# EAGLE design NanoSignalDecoder (EAGLE 7.7.0)
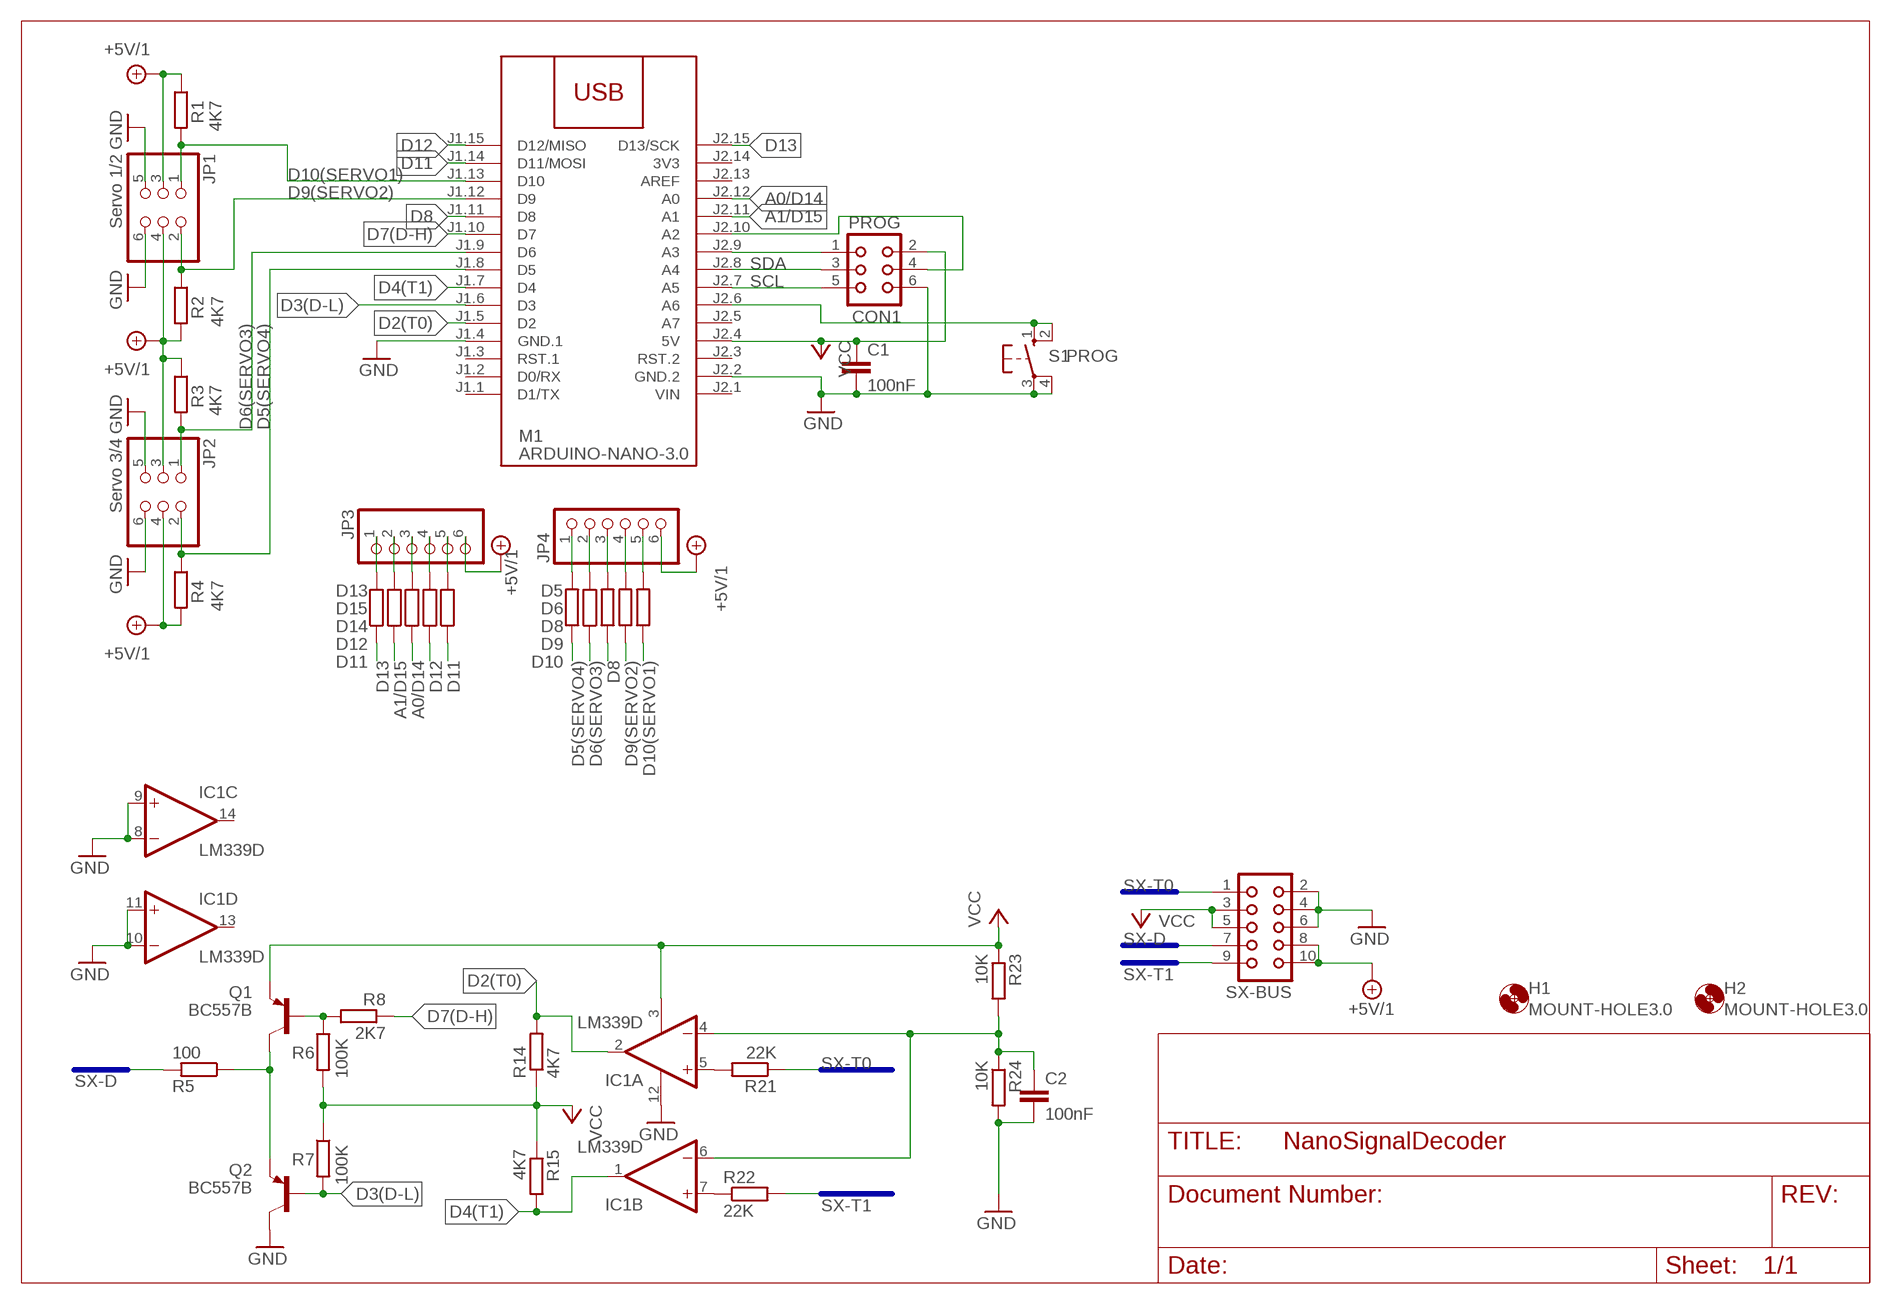
[diagram p0: schematic, sheet 1]

## Parts
C1  100nF  C-EUC0805  [C0805]
C2  100nF  C-EUC0805  [C0805]
CON1  PROG  CON06  [CON06]
D5  500  R-EU_R0805  [R0805]
D6  500  R-EU_R0805  [R0805]
D8  500  R-EU_R0805  [R0805]
D9  500  R-EU_R0805  [R0805]
D10  500  R-EU_R0805  [R0805]
D11  500  R-EU_R0805  [R0805]
D12  500  R-EU_R0805  [R0805]
D13  500  R-EU_R0805  [R0805]
D14  500  R-EU_R0805  [R0805]
D15  500  R-EU_R0805  [R0805]
H1  MOUNT-HOLE3.0  [3,0]
H2  MOUNT-HOLE3.0  [3,0]
IC1  LM339D  [SO14]
JP1  Servo 1/2  PINHD-2X3/90  [2X03/90]
JP2  Servo 3/4  PINHD-2X3/90  [2X03/90]
JP3  PINHD-1X6  [1X06]
JP4  PINHD-1X6  [1X06]
M1  ARDUINO-NANO-3.0  [ARDUINO-NANO-3.0]
Q1  BC557B  [TO92-EBC]
Q2  BC557B  [TO92-EBC]
R1  4K7  R-EU_R0805  [R0805]
R2  4K7  R-EU_R0805  [R0805]
R3  4K7  R-EU_R0805  [R0805]
R4  4K7  R-EU_R0805  [R0805]
R5  100  R-EU_R0805  [R0805]
R6  100K  R-EU_R0805  [R0805]
R7  100K  R-EU_R0805  [R0805]
R8  2K7  R-EU_R0805  [R0805]
R14  4K7  R-EU_R0805  [R0805]
R15  4K7  R-EU_R0805  [R0805]
R21  22K  R-EU_R0805  [R0805]
R22  22K  R-EU_R0805  [R0805]
R23  10K  R-EU_R0805  [R0805]
R24  10K  R-EU_R0805  [R0805]
S1  PROG  10-XX  [B3F-10XX]
SX-BUS  CON10  [CON10]

## Nets
+5V/1: JP1.3 JP1.4 JP2.3 JP2.4 JP3.6 JP4.6 R1.1 R2.2 R3.1 R4.2 SX-BUS.8 SX-BUS.10
A0/D14: D14.1 M1.J2.12(A0)
A1/D15: D15.1 M1.J2.11(A1)
D2(T0): IC1.2(A:OUT) M1.J1.5(D2) R14.2
D3(D-L): M1.J1.6(D3) Q2.B R7.2
D4(T1): IC1.1(B:OUT) M1.J1.7(D4) R15.2
D5(SERVO4): D5.1 JP2.2 M1.J1.8(D5) R4.1
D6(SERVO3): D6.1 JP2.1 M1.J1.9(D6) R3.2
D7(D-H): M1.J1.10(D7) R8.1
D8: D8.1 M1.J1.11(D8)
D9(SERVO2): D9.1 JP1.2 M1.J1.12(D9) R2.1
D10(SERVO1): D10.1 JP1.1 M1.J1.13(D10) R1.2
D11: D11.1 M1.J1.14(D11/MOSI)
D12: D12.1 M1.J1.15(D12/MISO)
D13: D13.1 M1.J2.15(D13/SCK)
GND: C1.2 C2.2 CON1.6 IC1.8(C:-IN) IC1.9(C:+IN) IC1.10(D:-IN) IC1.11(D:+IN) IC1.12(P:GND) JP1.5 JP1.6 JP2.5 JP2.6 M1.J1.4(GND.1) M1.J2.2(GND.2) Q2.C R24.2 S1.3(P) S1.4(P1) SX-BUS.2 SX-BUS.4 SX-BUS.6
N$2: D8.2 JP4.3
N$3: D5.2 JP4.1
N$4: D13.2 JP3.1
N$5: D6.2 JP4.2
N$6: D15.2 JP3.2
N$7: C2.1 IC1.4(A:-IN) IC1.6(B:-IN) R23.2 R24.1
N$8: Q1.C Q2.E R5.1
N$9: D9.2 JP4.4
N$10: D10.2 JP4.5
N$11: D14.2 JP3.3
N$12: D12.2 JP3.4
N$13: D11.2 JP3.5
N$14: Q1.B R6.1 R8.2
N$15: M1.J2.6(A6) S1.1(S) S1.2(S1)
N$16: CON1.1 M1.J2.9(A3)
N$22: CON1.4 M1.J2.10(A2)
N$30: IC1.5(A:+IN) R21.2
N$31: IC1.7(B:+IN) R22.1
SCL: CON1.5 M1.J2.7(A5)
SDA: CON1.3 M1.J2.8(A4)
SX-D: R5.2 SX-BUS.7
SX-T0: R21.1 SX-BUS.1
SX-T1: R22.2 SX-BUS.9
VCC: C1.1 CON1.2 IC1.3(P:V+) M1.J2.4(5V) Q1.E R6.2 R7.1 R14.1 R15.1 R23.1 SX-BUS.3 SX-BUS.5
Unconnected: IC1.13(D:OUT) IC1.14(C:OUT) M1.J1.1(D1/TX) M1.J1.2(D0/RX) M1.J1.3(RST.1) M1.J2.3(RST.2) M1.J2.5(A7) M1.J2.13(AREF)

## Buses
SX-T0
SX-T1
SX-D

## Power pins joined to a net without a drawn wire
3V3: M1.J2.14(3V3)
VIN: M1.J2.1(VIN)

## Library data of the parts
C1 C2 = resistor:C-EU: CAPACITOR, European symbol
CON1 = con-harting:CON06: CONNECTOR; OC_FARNELL: unknown; OC_NEWARK: unknown
D5 D6 D8-D15 R1-R8 R15 R21 = rcl:R-EU_: RESISTOR, European symbol
H1 H2 = holes:MOUNT-HOLE: MOUNTING HOLE with drill center marker
IC1 = linear:LM339: Low Power Low Offset Voltage Quad Comparators with open collector; LM139/LM239/LM339/LM2901/LM3302
JP1 JP2 = pinhead:PINHD-2X3: PIN HEADER
JP3 JP4 = pinhead:PINHD-1X6: PIN HEADER
M1 = diy-modules:ARDUINO-NANO-3.0: Arduino Nano 3.0
Q1 Q2 = transistor-pnp:BC557*: PNP Transistror
R14 R22-R24 = resistor:R-EU_: RESISTOR, European symbol
S1 = switch-omron:10-XX: OMRON SWITCH; MPN: B3F-1000; OC_FARNELL: 176432; OC_NEWARK: 36M3542
SX-BUS = con-harting:CON10: CONNECTOR; OC_FARNELL: unknown; OC_NEWARK: unknown

## Board
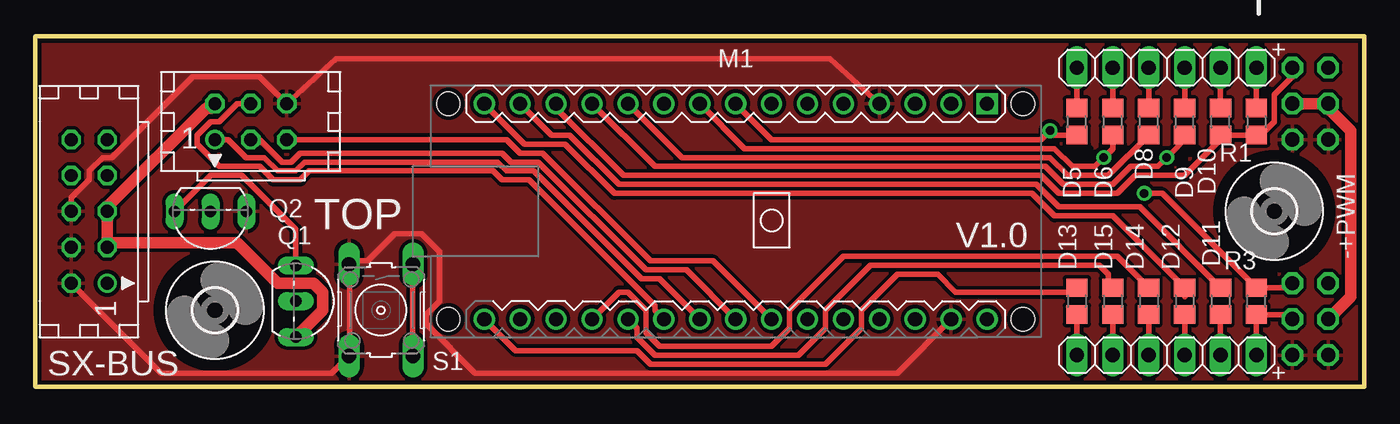
[diagram p1: board, top side]
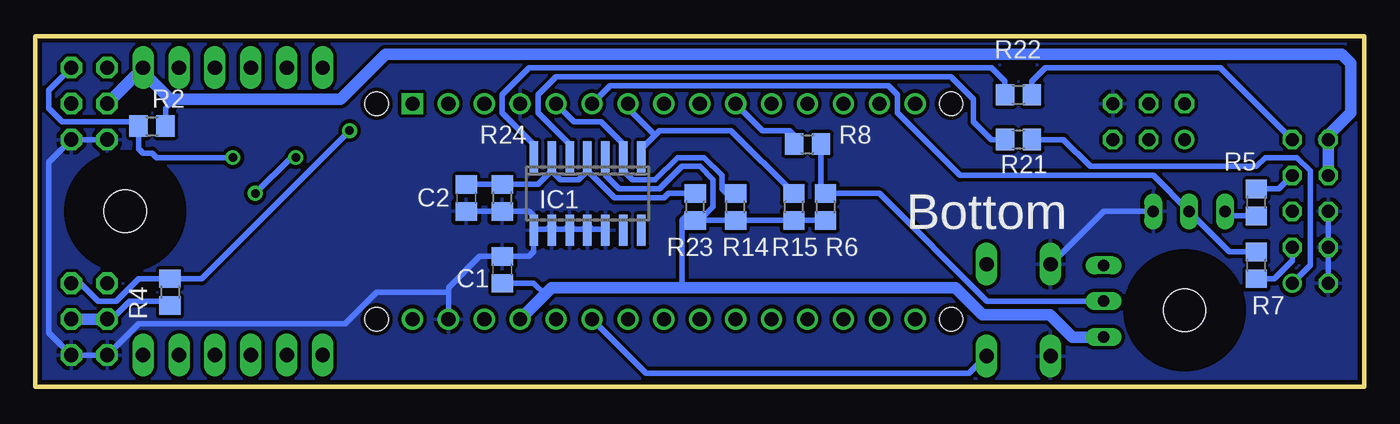
[diagram p2: board, bottom side, seen from below]

Size 93.98 x 24.77 mm. Coordinates in mm from the lower left corner, seen from the top.
Outline: 0,0 0,24.77 93.98,24.77 93.98,0 0,0
Copper layers (1*16): Top 0.035mm / dielectric 0.2mm / Bottom 0.035mm
Design rules "Eagle_WEdirekt_150_check *": minimum track width 6mil, minimum drill 0.25mm, track to track 6mil, track to pad 8mil, pad to pad 8mil, via to via 6mil, smd to smd 8mil, copper to edge 12mil, drill to drill 24mil, minimum pad ring 9mil, minimum via ring 9mil, stop-mask expansion 3mil, vias tented up to drill 0mil, thermal gap 12mil
tRestrict: area 17.1,4.4 to 18.1,5.1; area 18.1,4.8 to 18.7,5.1; area 16.8,4.1 to 17.5,4.4; area 77.8,16.2 to 79.4,16.5; area 76.5,16.5 to 77.2,16.8; area 81,15.6 to 81.3,16.8; area 81.6,16.5 to 82.2,16.8; area 73,16.2 to 74.6,16.8; area 86.7,20.6 to 87.3,21; area 76.2,8.3 to 76.5,8.6; area 76.5,7.9 to 76.8,8.3; area 86,7.9 to 86.7,8.3; 3 more areas
bRestrict: area 39.1,12.4 to 39.4,13; area 45.4,12.4 to 45.7,12.7; area 61.9,13 to 62.5,13.7; area 85.7,6.7 to 86.4,7; area 86.4,6.7 to 87,7; area 86.7,6.3 to 87,6.7; area 85.7,20 to 87.3,20.6; area 85.1,19.7 to 87.6,20; area 87.6,19.1 to 87.9,19.7; area 23.5,21.9 to 25.4,22.9; area 0.3,23.8 to 1,24.4; area 4.1,8.9 to 4.4,9.2; 1 more areas

### Footprints (pad centres in the part's own frame; a part is rotated, then mirrored left to right if it is on the bottom)
C0805 = smd 1.3 x 1.5: 1 -0.95,0; 2 0.95,0
CON06 = drill 0.914: 1 -2.54,-1.27 | drill 0.914 octagon: 2 -2.54,1.27; 3 0,-1.27; 4 0,1.27; 5 2.54,-1.27; 6 2.54,1.27
R0805 = smd 1.3 x 1.5: 1 -0.95,0; 2 0.95,0
3,0 = hole 3: 0,0
SO14 = smd 0.6 x 2.2: 1 -3.81,-2.6; 2 -2.54,-2.6; 3 -1.27,-2.6; 4 0,-2.6; 5 1.27,-2.6; 6 2.54,-2.6; 7 3.81,-2.6; 8 3.81,2.6; 9 2.54,2.6; 10 1.27,2.6; 11 0,2.6; 12 -1.27,2.6; 13 -2.54,2.6; 14 -3.81,2.6
2X03/90 = drill 1.016 octagon: 1 -2.54,-6.35; 2 -2.54,-3.81; 3 0,-6.35; 4 0,-3.81; 5 2.54,-6.35; 6 2.54,-3.81
1X06 = drill 1.016 long: 1 -6.35,0; 2 -3.81,0; 3 -1.27,0; 4 1.27,0; 5 3.81,0; 6 6.35,0
ARDUINO-NANO-3.0 = drill 1 square: J1.1 17.78,7.62 | drill 1: J1.2 15.24,7.62; J1.3 12.7,7.62; J1.4 10.16,7.62; J1.5 7.62,7.62; J1.6 5.08,7.62; J1.7 2.54,7.62; J1.8 0,7.62; J1.9 -2.54,7.62; J1.10 -5.08,7.62; J1.11 -7.62,7.62; J1.12 -10.16,7.62; J1.13 -12.7,7.62; J1.14 -15.24,7.62; J1.15 -17.78,7.62; J2.1 17.78,-7.62; J2.2 15.24,-7.62; J2.3 12.7,-7.62; J2.4 10.16,-7.62; J2.5 7.62,-7.62; J2.6 5.08,-7.62; J2.7 2.54,-7.62; J2.8 0,-7.62; J2.9 -2.54,-7.62; J2.10 -5.08,-7.62; J2.11 -7.62,-7.62; J2.12 -10.16,-7.62; J2.13 -12.7,-7.62; J2.14 -15.24,-7.62; J2.15 -17.78,-7.62 | hole 1.651: -20.32,7.62; -20.32,-7.62; 20.32,-7.62; 20.32,7.62
TO92-EBC = drill 0.813 long: B 0,-1.27; C -2.54,-1.27; E 2.54,-1.27
B3F-10XX = drill 1.016 long: 1 -3.251,2.261; 2 3.251,2.261; 3 -3.251,-2.261; 4 3.251,-2.261
CON10 = drill 0.914: 1 -5.08,-1.27 | drill 0.914 octagon: 2 -5.08,1.27; 3 -2.54,-1.27; 4 -2.54,1.27; 5 0,-1.27; 6 0,1.27; 7 2.54,-1.27; 8 2.54,1.27; 9 5.08,-1.27; 10 5.08,1.27

### Placement (x,y rotation side)
C1  60.96,8.26 90 bottom
C2  63.5,13.34 270 bottom
CON1  15.24,18.73 0 top
D5  73.66,18.73 90 top
D6  76.2,18.73 90 top
D8  78.74,18.73 90 top
D9  81.28,18.73 90 top
D10  83.82,18.73 90 top
D11  83.82,6.03 270 top
D12  81.28,6.03 270 top
D13  73.66,6.03 270 top
D14  78.74,6.03 270 top
D15  76.2,6.03 270 top
H1  12.7,5.4 0 top
H2  87.63,12.38 0 top
IC1  54.93,13.65 180 bottom
JP1  95.25,20 270 top
JP2  95.25,4.76 270 top
JP3  80.01,2.22 0 top
JP4  80.01,22.54 0 top
M1  49.53,12.38 0 top
Q1  19.68,6.03 270 top
Q2  12.38,11.11 180 top
R1  86.36,18.73 270 top
R2  85.72,18.41 0 bottom
R3  86.36,6.03 90 top
R4  84.45,6.67 270 bottom
R5  7.62,13.02 90 bottom
R6  38.1,12.7 270 bottom
R7  7.62,8.57 90 bottom
R8  39.37,17.14 0 bottom
R14  44.45,12.7 90 bottom
R15  40.32,12.7 90 bottom
R21  24.45,17.46 180 bottom
R22  24.45,20.64 0 bottom
R23  47.31,12.7 90 bottom
R24  60.96,13.34 270 bottom
S1  24.45,5.4 270 top
SX-BUS  3.81,12.38 90 top

### Tracks (layer width: path | path; a pad name or v marks a point on that pad's centre or on a via)
+5V/1
  Top 0.406: JP4.6 86.36,20 86.68,19.68 86.36,19.37 R1.1 | JP3.6 86.36,4.76 86.04,5.08 86.36,5.4 R3.1 88.58,5.08 JP2.3
  Top 0.813: JP1.3 JP1.4 91.44,19.68 93.03,18.1 93.03,6.35 JP2.4
  Bottom 0.406: JP2.3 88.58,4.76 87.31,6.03 84.45,6.03 R4.2 | 84.3,20.16 84.77,19.68 R2.2
  Bottom 0.813: JP2.4 JP2.3 | SX-BUS.8 SX-BUS.10 | 2.86,17.46 SX-BUS.10 | JP1.3 JP4.6 86.36,22.23 84.3,20.16 84.14,20.32 72.39,20.32 69.22,23.5 1.59,23.5 0.95,22.86 0.95,19.37 2.54,17.78 SX-BUS.10
A0/D14
  Top 0.406: 78.42,6.67 78.74,6.67 D14.1 76.52,9.21 57.15,9.21 53.34,5.4 53.34,4.13 52.07,2.86 44.13,2.86 43.18,3.81 43.18,5.4 41.91,6.67 41.27,6.67 M1.J2.12
A1/D15
  Top 0.406: 75.88,6.67 76.2,6.67 D15.1 | 75.88,6.99 D15.1 | 75.88,6.99 75.88,7.94 75.25,8.57 59.05,8.57 55.88,5.4 55.88,4.13 53.98,2.22 43.81,2.22 42.55,3.49 42.55,4.13 M1.J2.11 | 75.88,6.99 D15.1
D2(T0)
  Bottom 0.406: M1.J1.5 55.88,18.73 53.98,18.73 52.39,17.14 IC1.2 52.39,15.24 51.75,14.61 50.16,14.61 48.58,16.19 46.67,16.19 45.4,14.92 45.4,13.97 45.09,13.65 R14.2
D3(D-L)
  Bottom 0.406: R7.2 9.53,9.53 Q2.B 14.92,14.92 28.57,14.92 33.02,19.37 33.02,20.64 33.66,21.27 53.34,21.27 M1.J1.6
D4(T1)
  Bottom 0.406: 50.16,17.78 51.12,16.83 IC1.1 | 50.16,17.78 49.85,18.1 44.77,18.1 R15.2 | 50.16,17.78 52.07,19.68 M1.J1.7
D5(SERVO4)  (via drill 0.6)
  Top 0.406: 73.66,17.46 D5.1 | M1.J1.8 52.07,17.46 71.12,17.46 v71.75,18.1 72.07,17.78 D5.1 | D5.1
  Bottom 0.406: R4.1 82.23,7.62 v71.75,18.1 | JP2.2 90.81,7.3 89.53,6.03 88.27,6.03 86.68,7.62 R4.1 | R4.1
D6(SERVO3)  (via drill 0.6)
  Top 0.406: 86.36,6.67 R3.2 | R3.2 79.69,13.65 v78.42,13.65 | JP2.1 88.58,6.99 R3.2 | M1.J1.9 50.16,16.83 72.07,16.83 73.34,15.56 74.93,15.56 v75.56,16.19 76.2,16.83 D6.1
  Bottom 0.406: v78.42,13.65 75.88,16.19 v75.56,16.19
D7(D-H)
  Bottom 0.406: M1.J1.10 42.55,18.1 40.64,18.1 40.32,17.78 R8.1
D8
  Top 0.406: M1.J1.11 45.72,16.19 71.75,16.19 73.03,14.92 75.88,14.92 D8.1
D9(SERVO2)  (via drill 0.6)
  Top 0.406: D9.1 81.6,17.46 D9.1 | M1.J1.12 43.81,15.56 71.44,15.56 72.71,14.29 76.2,14.29 77.47,15.56 79.38,15.56 v80.01,16.19 81.6,17.78 81.28,18.1 D9.1
  Bottom 0.406: JP1.2 93.03,20.95 93.03,19.68 92.08,18.73 86.68,18.73 86.36,18.41 R2.1 86.68,16.83 86.36,16.51 85.72,16.51 85.41,16.19 v80.01,16.19
D10(SERVO1)
  Top 0.406: 83.82,17.46 84.14,17.46 D10.1 | 86.36,17.46 86.68,17.46 | 86.36,17.46 R1.2 | M1.J1.13 36.83,19.68 41.59,14.92 71.12,14.92 72.39,13.65 76.52,13.65 77.79,14.92 81.28,14.92 83.82,17.46 | 83.82,17.46 D10.1 | D10.1 R1.2 | 86.36,17.46 87.63,18.73 87.63,20.64 88.9,21.91 JP1.1 | R1.2
D11
  Top 0.406: 83.82,6.67 D11.1 78.11,12.7 72.39,12.7 70.8,14.29 41.27,14.29 37.78,17.78 36.51,17.78 M1.J1.14
D12
  Top 0.406: 81.28,6.35 D12.1 76.2,12.06 72.07,12.06 70.48,13.65 40.96,13.65 37.47,17.14 34.61,17.14 M1.J1.15
D13
  Top 0.406: 73.34,6.67 73.66,6.67 D13.1 73.34,6.67 | 73.34,6.67 65.09,6.67 63.82,7.94 60.96,7.94 58.42,5.4 58.42,4.13 55.88,1.59 43.5,1.59 42.55,2.54 33.97,2.54 M1.J2.15
GND
  Top 0.406: M1.J1.4 56.2,23.18 21.27,23.18 CON1.6 15.88,21.91 11.11,21.91 5.4,16.19 4.76,16.19 3.81,15.24 3.81,14.61 2.54,13.34 SX-BUS.6 | SX-BUS.2 8.89,0.95 20.95,0.95 21.91,1.91 S1.4 22.23,2.22 22.23,8.57 S1.3 22.23,8.89 23.5,8.89 25.4,10.79 27.3,10.79 28.57,9.53 28.57,6.03 27.62,5.08 27.62,4.45 31.11,0.95 60.96,0.95 M1.J2.2
  Bottom 0.406: JP1.5 JP1.6 93.03,15.88 93.03,3.81 JP2.6 JP2.5 86.68,4.45 72.07,4.45 69.85,6.67 64.77,6.67 | 54.61,11.11 53.66,11.11 IC1.12 | 54.61,11.11 54.93,11.11 IC1.11 | 55.88,11.11 55.24,11.11 54.93,11.43 54.61,11.11 | 55.88,11.11 56.2,11.11 IC1.10 | 57.15,11.11 56.52,11.11 56.2,11.43 55.88,11.11 | 57.15,11.11 57.47,11.11 IC1.9 | 58.74,11.11 57.78,11.11 57.47,11.43 57.15,11.11 | SX-BUS.6 SX-BUS.4 SX-BUS.2 | C1.2 59.05,9.21 58.74,9.53 IC1.8 58.74,11.11 | R24.2 C2.2 | 58.74,11.11 58.74,12.06 59.05,12.38 R24.2 | R24.2 | Q2.C 18.41,12.38 21.91,8.89 S1.3 | 64.77,6.67 64.77,6.99 62.55,9.21 C1.2 | 64.77,6.67 M1.J2.2 | C1.2
  pour Top (isolate 0.254): 0,0 0,24.77 93.98,24.77 93.98,0
  pour Bottom (isolate 0.254): 0,0 0,24.77 93.98,24.77 93.98,0
N$2
  Top 0.406: JP4.3 78.74,20 79.06,19.68 78.74,19.37 D8.2
N$3
  Top 0.406: JP4.1 D5.2
N$4
  Top 0.406: JP3.1 73.66,4.76 73.34,5.08 73.66,5.4 D13.2
N$5
  Top 0.406: JP4.2 D6.2
N$6
  Top 0.406: JP3.2 76.2,4.76 75.88,5.08 76.2,5.4 D15.2
N$7
  Bottom 0.406: R24.1 C2.1 | 57.47,15.24 58.42,14.29 R24.1 | R24.1 | 54.93,15.24 55.56,14.61 56.83,14.61 57.47,15.24 | 57.47,15.24 IC1.6 | 54.93,15.24 53.02,13.34 49.53,13.34 49.21,13.65 R23.2 | 54.93,15.24 IC1.4
N$8
  Top 0.406: Q1.C 18.41,11.11 14.61,14.92 12.38,14.92 Q2.E
  Bottom 0.406: Q2.E 9.53,12.06 R5.1
N$9
  Top 0.406: D9.2 JP4.4
N$10
  Top 0.406: JP4.5 83.82,20 83.5,19.68 83.82,19.37 D10.2
N$11
  Top 0.406: JP3.3 78.74,4.76 78.42,5.08 78.74,5.4 D14.2
N$12
  Top 0.406: JP3.4 81.28,4.76 80.96,5.08 81.28,5.4 D12.2
N$13
  Top 0.406: JP3.5 83.82,4.76 83.5,5.08 83.82,5.4 D11.2
N$14
  Bottom 0.406: 38.1,17.14 38.42,17.46 38.73,17.14 R8.2 38.42,13.65 | 38.42,13.65 38.1,13.34 R6.1 | Q1.B 26.67,6.03 34.29,13.65 R6.1 | 38.42,13.65 R6.1
N$15
  Top 0.406: S1.2 26.67,2.22 26.67,8.57 S1.1
  Bottom 0.406: M1.J2.6 50.8,0.95 27.94,0.95 26.99,1.91 S1.2
N$16
  Top 0.406: M1.J2.9 44.13,7.62 42.86,7.62 35.24,15.24 33.34,15.24 32.7,15.88 19.05,15.88 18.41,15.24 17.14,15.24 16.19,16.19 14.92,16.19 13.65,17.46 CON1.1
N$22
  Top 0.406: M1.J2.10 43.81,5.4 43.81,5.71 34.92,14.61 33.02,14.61 32.38,15.24 19.37,15.24 18.73,14.61 16.83,14.61 15.88,15.56 13.02,15.56 11.43,17.14 11.43,17.78 12.38,18.73 13.02,18.73 14.29,20 CON1.4
N$30
  Bottom 0.406: IC1.5 56.2,17.14 58.42,19.37 58.42,20.64 57.15,21.91 29.21,21.91 27.62,20.32 27.62,18.73 26.35,17.46 R21.2
N$31
  Bottom 0.406: IC1.7 58.74,17.14 60.96,19.37 60.96,20.64 59.05,22.54 26.35,22.54 25.4,21.59 R22.1 | 25.72,20.64 R22.1 | R22.1
SCL
  Top 0.406: CON1.5 33.34,17.46 34.29,16.51 35.88,16.51 43.5,8.89 47.94,8.89 M1.J2.7
SDA
  Top 0.406: M1.J2.8 46.04,8.26 43.18,8.26 35.56,15.88 33.66,15.88 33.02,16.51 18.73,16.51 18.1,15.88 17.46,15.88 15.88,17.46 CON1.3
SX-D
  Bottom 0.406: SX-BUS.7 6.03,13.97 R5.2
SX-T0
  Bottom 0.406: SX-BUS.1 3.81,8.57 3.81,15.24 4.76,16.19 6.99,16.19 7.62,15.56 19.37,15.56 21.27,17.46 R21.1
SX-T1
  Bottom 0.406: 23.81,20.64 R22.2 23.5,21.59 22.54,22.54 10.16,22.54 SX-BUS.9
VCC
  Top 0.813: CON1.2 12.38,19.68 12.06,19.68 5.08,12.7 SX-BUS.5 SX-BUS.3 5.4,10.16 14.29,10.16 17.14,7.3 19.68,7.3 20.32,6.67 20.32,5.4 Q1.E
  Bottom 0.406: SX-BUS.3 5.08,8.89 6.35,7.62 R7.1 | 48.26,6.99 48.26,11.75 47.94,12.06 R23.1 | 46.99,11.75 R23.1 | 46.99,11.75 46.04,12.7 46.04,14.61 46.99,15.56 48.26,15.56 49.85,13.97 52.7,13.97 53.66,14.92 IC1.3 | 46.99,11.75 R14.1 | 46.99,11.75 R23.1 | R15.1 R14.1 | R14.1 | R15.1 R6.2 | R15.1 | 57.94,6.51 58.74,7.3 C1.1
  Bottom 0.813: Q1.E 20.64,3.49 22.23,5.08 26.99,5.08 28.89,6.99 48.26,6.99 57.47,6.99 57.94,6.51 M1.J2.4

### Text on the board
tNames: + | -+PWM | TOP | V1.0 | +
bNames: Bottom
tDocu: BOTTOM
bDocu: TOP